# Altium schematic sheet Collective_FAULT_logic_new.SchDoc
size A4; CompanyName: Technische Hochschule Nürnberg Georg Simon Ohm; Address1: Fürther Straße 250; Address2: 90429 Nürnberg; Address3: GERMANY; CompanyName2: Institut ELSYS
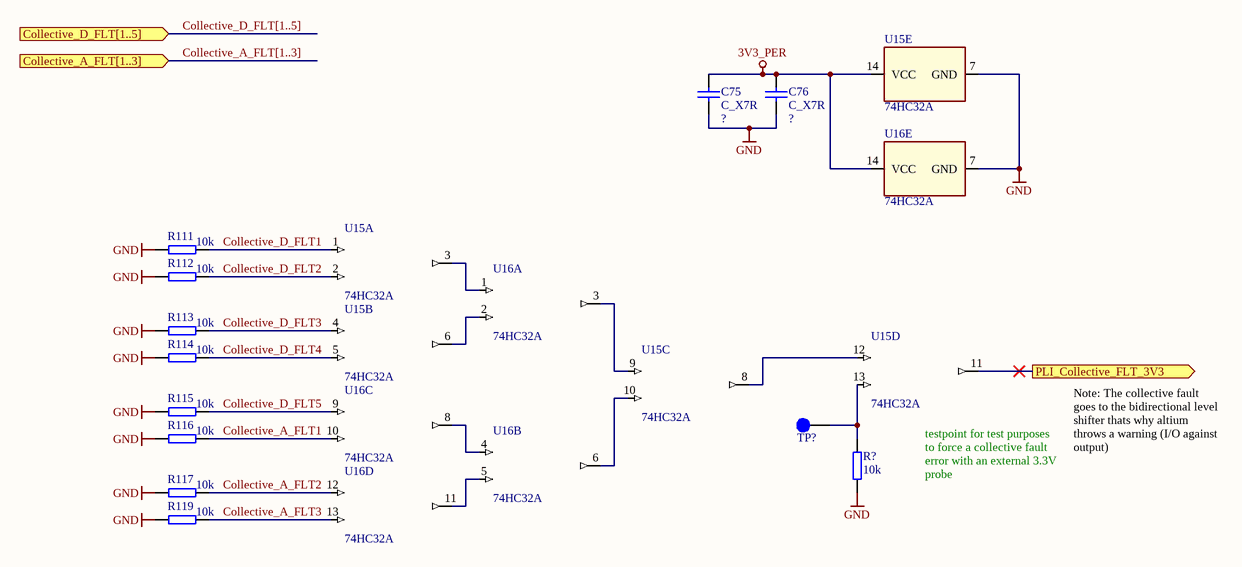
[diagram p0: Collective_FAULT_logic_new.SchDoc]

## Parts
C75  C_X7R  [CAPC_0603]
C76  C_X7R  [CAPC_0603]
R111  10k  [R_0603_N]
R112  10k  [R_0603_N]
R113  10k  [R_0603_N]
R114  10k  [R_0603_N]
R115  10k  [R_0603_N]
R116  10k  [R_0603_N]
R117  10k  [R_0603_N]
R119  10k  [R_0603_N]
R?  10k  [R_0603_N]
TP?  Testpoint 1mm  [TP_1mm]  (value not drawn)  (no BOM)
U15  74HC32A  [TSSOP14]  (parts A,B,C,D,E of 5)
U16  74HC32A  [TSSOP14]  (parts A,B,C,D,E of 5)

## Ports
Collective_A_FLT[1..3] (in), Collective_D_FLT[1..5] (in), PLI_Collective_FLT_3V3 (out)

## Nets
3V3_PER: C75.2 C76.2 U15.14(VCC) U16.14(VCC)
GND: C75.1 C76.1 R111.1 R112.1 R113.1 R114.1 R115.1 R116.1 R117.1 R119.1 R?.1 U15.7(GND) U16.7(GND)
Collective_A_FLT1: R116.2 U16.10(3B)
Collective_A_FLT2: R117.2 U16.12(4A)
Collective_A_FLT3: R119.2 U16.13(4B)
Collective_D_FLT1: R111.2 U15.1(1A)
Collective_D_FLT2: R112.2 U15.2(1B)
Collective_D_FLT3: R113.2 U15.4(2A)
Collective_D_FLT4: R114.2 U15.5(2B)
Collective_D_FLT5: R115.2 U16.9(3A)
PLI_Collective_FLT_3V3: U15.11(4Y) ; port PLI_Collective_FLT_3V3
NetR?_2: R?.2 TP?.1 U15.13(4B)
NetU15_3: U15.3(1Y) U16.1(1A)
NetU15_6: U15.6(2Y) U16.2(1B)
NetU15_8: U15.8(3Y) U15.12(4A)
NetU15_9: U15.9(3A) U16.3(1Y)
NetU15_10: U15.10(3B) U16.6(2Y)
NetU16_4: U16.4(2A) U16.8(3Y)
NetU16_5: U16.5(2B) U16.11(4Y)

## Buses and harness runs
bus Collective_A_FLT[1..3] = port Collective_A_FLT[1..3]
bus Collective_D_FLT[1..5] = port Collective_D_FLT[1..5]

## Notes on the sheet
- (near U15) testpoint for test purposes to force a collective fault error with an external 3.3V probe
- Note: The collective fault goes to the bidirectional level shifter thats why altium throws a warning (I/O against output)
- Title
- Size:
- Date:
- A4
- Revision:
- Time:
- Sheet
- of
- Author:
- Project:

## Library data of the parts
C75 C76 = C_X7R_SMALL: Standard X7R SMD capacitor. This kind of dielectricum should be used for decoupling applications. Bigger capacity is available but not for the given voltage rating.; MPN: C<pkg[inch]><2d cap [pf] + #zeros><ToleranceSym><VoltageSym>RACTU; MF: KEMET; Parameter1: 5; Parameter1Desc: Voltage Symbol; Parameter2: J; Parameter2Desc: Tolerance Symbol; MaxVoltage: 100; MaxCap: 100n; MinCap: 10p; Created: 2019-12-08_Thilo_Wendt; Package: CAPC_0603; HelpURL: https://content.kemet.com/datasheets/KEM_C1002_X7R_SMD.pdf; ComponentLink1Description: Datasheet; ComponentLink1URL: https://content.kemet.com/datasheets/KEM_C1002_X7R_SMD.pdf; Supplier Link 1: https://de.farnell.com/w/c/passive-bauelemente/kondensatoren/keramikkondensatoren/keramik-vielschichtkondensatoren-mlcc-smd?brand=kemet&kapazitatstoleranz=posneg-10pc&dielektrikum=x7r; Supplier 2: Mouser; Supplier Part Number 2: 80-<MPN>; Value: ?
R111-R117 R119 R? = R_0603: SMD Resistor 0603; MPN: MCWR06X1002FTL; Tolerance: 1%; Voltage: 50V; Power: 100mW; MF: Multicomp; Package: 0603; Value: 10k; Created: 2018_09_06_AGeiger; Supplier 1: Farnell; Supplier Part Number 1: 2447230
TP? = TP_1mm: Created: 2018_06_25_AGeiger; Value: Testpoint 1mm
U15 U16 = 74HC32A: 74HC32A Quad 2-input OR gate; MPN: NLV74HC32ADTR2G; MF: ON Semiconductor; Qualification: AEC-Q100; Value: 74HC32A; Created: 2018_11_15_AGeiger; Package: TSSOP-14; Supplier 1: Mouser; Supplier Part Number 1: 863-NLV74HC32ADTR2G; ComponentLink1Description: Datasheet; ComponentLink1URL: https://www.mouser.de/datasheet/2/308/MC74HC32A-D-96986.pdf; Supplier 2: Digi-Key; Supplier Part Number 2: NLV74HC32ADTR2GOSCT-ND